# EAGLE schematic example (EAGLE 9.0.1)
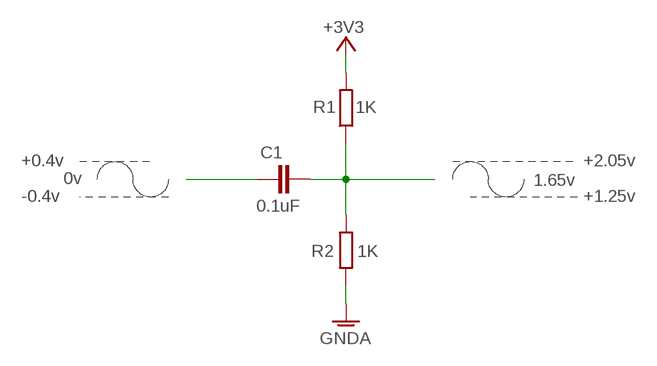
[diagram p0: schematic, sheet 1]

## Parts
C1  0.1uF  C-EUC1206  [C1206]
R1  1K  R-EU_R1206  [R1206]
R2  1K  R-EU_R1206  [R1206]

## Nets
+3V3: R1.2
GNDA: R2.1
N$1: C1.1
N$2: C1.2 R1.1 R2.2

## Notes on the sheet
- +2.05v
- +0.4v
- 1.65v
- 0v
- +1.25v
- -0.4v

## Library data of the parts
C1 = rcl:C-EU: CAPACITOR, European symbol; SPICEPREFIX: C
R1 R2 = rcl:R-EU_: RESISTOR, European symbol; SPICEPREFIX: R